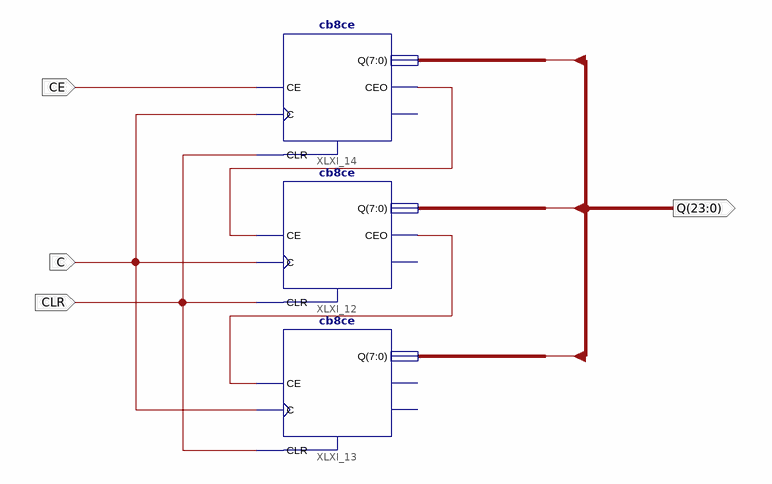
[diagram p0: schematic sheet 1]
// Xilinx ISE schematic Counter24bit.sch (spartan3e) as structural Verilog: 3 symbols, 4 ports
module Counter24bit (
  input  CLR,
  input  C,
  input  CE,
  output [23:0] Q
);

  wire XLXN_37, XLXN_38;
  wire [7:0] Led;

  cb8ce XLXI_14 (.C(C), .CE(CE), .CLR(CLR), .CEO(XLXN_38), .Q(Q[7:0]));  // open: TC
  cb8ce XLXI_12 (.C(C), .CE(XLXN_38), .CLR(CLR), .CEO(XLXN_37), .Q(Q[15:8]));  // open: TC
  cb8ce XLXI_13 (.C(C), .CE(XLXN_37), .CLR(CLR), .Q(Led));  // open: CEO, TC
endmodule
